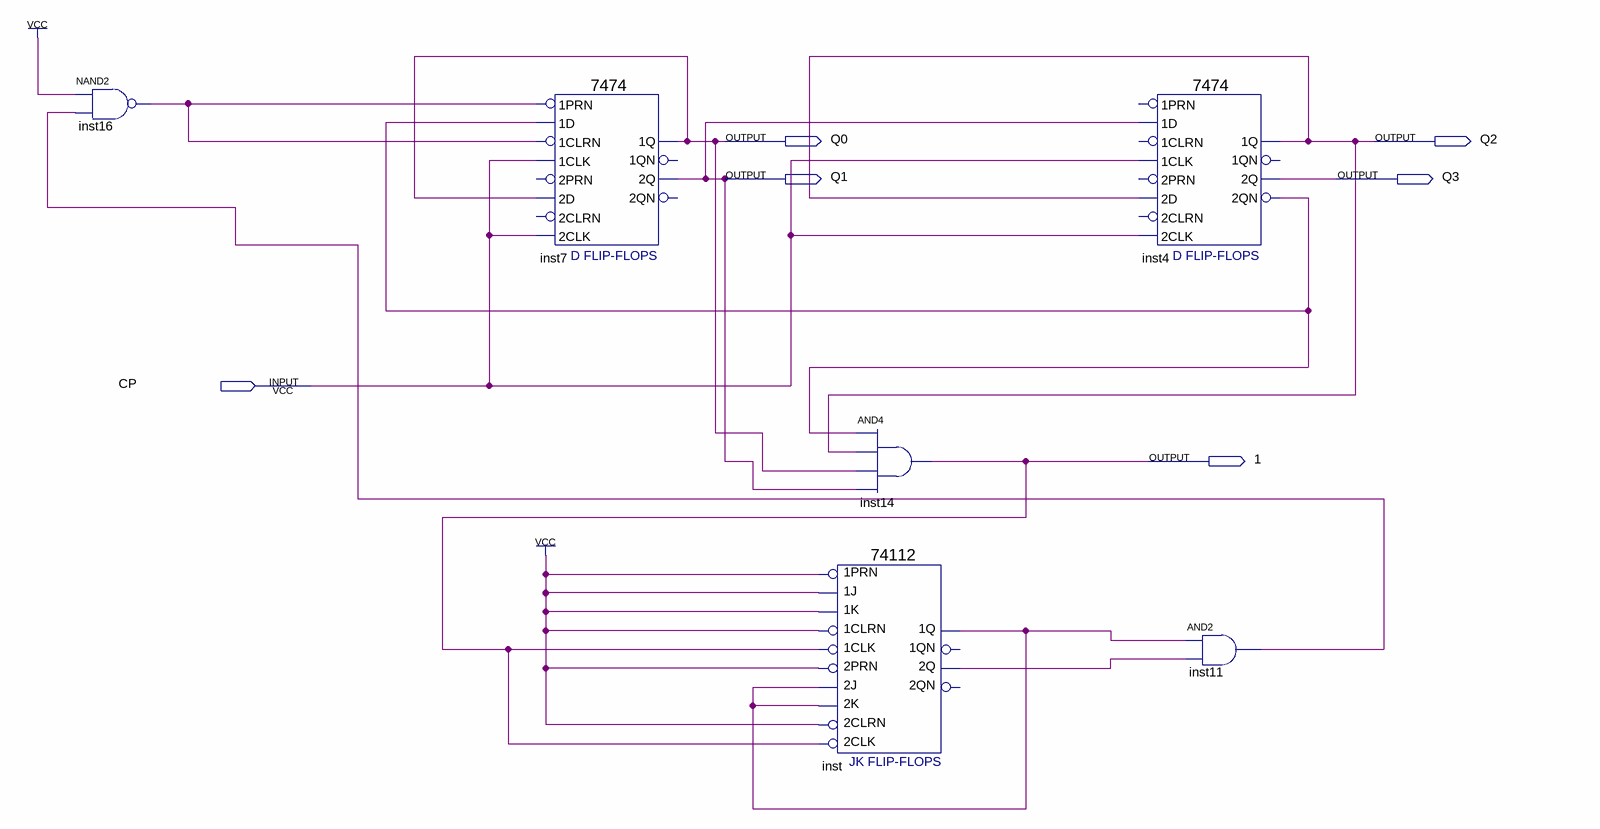
[diagram p0: schematic sheet]
// Quartus schematic TEST.bdf as structural Verilog: 6 symbols, 6 pins
module TEST (
  input  CP,
  output Q0,
  output Q2,
  output Q1,
  output Q3,
  output \1 
);

  wire inst4_2qn, inst11_out, inst16_out, inst_1q, inst_2q;

  nand inst16 (inst16_out, 1'b1, inst11_out);
  \7474  inst7 (
    .\2D (Q0), .\1CLK (CP), .\1D (inst4_2qn), .\1PRN (inst16_out), .\2CLK (CP), .\1CLRN (inst16_out),
    .\2Q (Q1), .\1Q (Q0));  // open: 2PRN, 2CLRN, 1QN, 2QN
  \74112  inst (
    .\1K (1'b1), .\1J (1'b1), .\1PRN (1'b1), .\1CLK (\1 ), .\1CLRN (1'b1), .\2K (inst_1q), .\2J (inst_1q),
    .\2PRN (1'b1), .\2CLK (\1 ), .\2CLRN (1'b1), .\2Q (inst_2q), .\1Q (inst_1q));  // open: 1QN, 2QN
  and inst14 (\1 , inst4_2qn, Q2, Q0, Q1);
  \7474  inst4 (
    .\2D (Q2), .\1CLK (CP), .\1D (Q1), .\2CLK (CP), .\2Q (Q3), .\2QN (inst4_2qn), .\1Q (Q2));  // open: 2PRN, 1PRN, 2CLRN, 1CLRN, 1QN
  and inst11 (inst11_out, inst_1q, inst_2q);
endmodule
